# Altium schematic sheet LED_String_AREM-90C0.SchDoc: STB Light Board - 940nm String
size A4; Author: flmoll; DrawnBy: flmoll; Organization: PBL; Revision: A; SheetNumber: 16; SheetTotal: 20
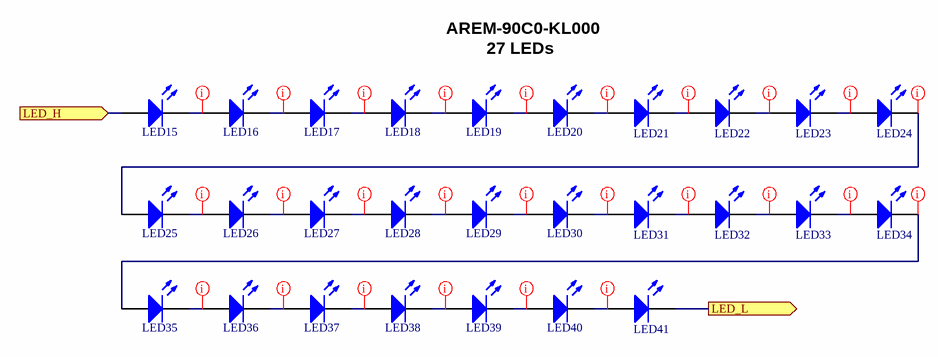
[diagram p0: LED_String_AREM-90C0.SchDoc]

## Parts
LED15  AREM-90C0-KL000  [AREM-80C0-LM000]  (value not drawn)
LED16  AREM-90C0-KL000  [AREM-80C0-LM000]  (value not drawn)
LED17  AREM-90C0-KL000  [AREM-80C0-LM000]  (value not drawn)
LED18  AREM-90C0-KL000  [AREM-80C0-LM000]  (value not drawn)
LED19  AREM-90C0-KL000  [AREM-80C0-LM000]  (value not drawn)
LED20  AREM-90C0-KL000  [AREM-80C0-LM000]  (value not drawn)
LED21  AREM-90C0-KL000  [AREM-80C0-LM000]  (value not drawn)
LED22  AREM-90C0-KL000  [AREM-80C0-LM000]  (value not drawn)
LED23  AREM-90C0-KL000  [AREM-80C0-LM000]  (value not drawn)
LED24  AREM-90C0-KL000  [AREM-80C0-LM000]  (value not drawn)
LED25  AREM-90C0-KL000  [AREM-80C0-LM000]  (value not drawn)
LED26  AREM-90C0-KL000  [AREM-80C0-LM000]  (value not drawn)
LED27  AREM-90C0-KL000  [AREM-80C0-LM000]  (value not drawn)
LED28  AREM-90C0-KL000  [AREM-80C0-LM000]  (value not drawn)
LED29  AREM-90C0-KL000  [AREM-80C0-LM000]  (value not drawn)
LED30  AREM-90C0-KL000  [AREM-80C0-LM000]  (value not drawn)
LED31  AREM-90C0-KL000  [AREM-80C0-LM000]  (value not drawn)
LED32  AREM-90C0-KL000  [AREM-80C0-LM000]  (value not drawn)
LED33  AREM-90C0-KL000  [AREM-80C0-LM000]  (value not drawn)
LED34  AREM-90C0-KL000  [AREM-80C0-LM000]  (value not drawn)
LED35  AREM-90C0-KL000  [AREM-80C0-LM000]  (value not drawn)
LED36  AREM-90C0-KL000  [AREM-80C0-LM000]  (value not drawn)
LED37  AREM-90C0-KL000  [AREM-80C0-LM000]  (value not drawn)
LED38  AREM-90C0-KL000  [AREM-80C0-LM000]  (value not drawn)
LED39  AREM-90C0-KL000  [AREM-80C0-LM000]  (value not drawn)
LED40  AREM-90C0-KL000  [AREM-80C0-LM000]  (value not drawn)
LED41  AREM-90C0-KL000  [AREM-80C0-LM000]  (value not drawn)

## Ports
LED_H (in, see LED_Driver_AREM-90C0[2A]), LED_L (out, see LED_Driver_AREM-90C0[2A])

## Nets
LED_H: LED15.2(A) ; port LED_H
LED_L: LED41.1(K) ; port LED_L
NetLED15_1: LED15.1(K) LED16.2(A)
NetLED16_1: LED16.1(K) LED17.2(A)
NetLED17_1: LED17.1(K) LED18.2(A)
NetLED18_1: LED18.1(K) LED19.2(A)
NetLED19_1: LED19.1(K) LED20.2(A)
NetLED20_1: LED20.1(K) LED21.2(A)
NetLED21_1: LED21.1(K) LED22.2(A)
NetLED22_1: LED22.1(K) LED23.2(A)
NetLED23_1: LED23.1(K) LED24.2(A)
NetLED24_1: LED24.1(K) LED25.2(A)
NetLED25_1: LED25.1(K) LED26.2(A)
NetLED26_1: LED26.1(K) LED27.2(A)
NetLED27_1: LED27.1(K) LED28.2(A)
NetLED28_1: LED28.1(K) LED29.2(A)
NetLED29_1: LED29.1(K) LED30.2(A)
NetLED30_1: LED30.1(K) LED31.2(A)
NetLED31_1: LED31.1(K) LED32.2(A)
NetLED32_1: LED32.1(K) LED33.2(A)
NetLED33_1: LED33.1(K) LED34.2(A)
NetLED34_1: LED34.1(K) LED35.2(A)
NetLED35_1: LED35.1(K) LED36.2(A)
NetLED36_1: LED36.1(K) LED37.2(A)
NetLED37_1: LED37.1(K) LED38.2(A)
NetLED38_1: LED38.1(K) LED39.2(A)
NetLED39_1: LED39.1(K) LED40.2(A)
NetLED40_1: LED40.1(K) LED41.2(A)

## Layout directives
net class LED: NetLED15_1, NetLED16_1, NetLED17_1, NetLED18_1, NetLED19_1, NetLED20_1, NetLED21_1, NetLED22_1, NetLED23_1, NetLED24_1, NetLED25_1, NetLED26_1, NetLED27_1, NetLED28_1, NetLED29_1, NetLED30_1, NetLED31_1, NetLED32_1, NetLED33_1, NetLED34_1, NetLED35_1, NetLED36_1, NetLED37_1, NetLED38_1, NetLED39_1, NetLED40_1

## Notes on the sheet
- AREM-90C0-KL000
- 27 LEDs
- 1
- 2
- 3
- 4
- A
- B
- C
- Project:
- D
- Date:
- Drawing number:
- Rev:
- Format:
- A4 Q
- Drawn by:
- Laboratory:
- Page
- Sheet:
- of
- File:

## Library data of the parts
LED15-LED41 = CMP-02057-1: Infrared (IR) Emitter 940nm 1.4V 70mA 13.4mW/sr @ 70mA (Typ) 120° 2-PLCC; Mfr: Broadcom Limited; Manufacturer: Broadcom; Base Product Number: AREM; Series: AREM-90C0-xx000; Type: Infrared (IR); Current - DC Forward (If) (Max): 70mA; Radiant Intensity (Ie) Min @ If: 13.4mW/sr @ 70mA (Typ); Wavelength: 940nm; Voltage - Forward (Vf) (Typ): 1.4V; Viewing Angle: 120°; Orientation: Top View; Operating Temperature: -40°C ~ 100°C; Mounting Type: Surface Mount; Package / Case: 2-PLCC; Supplier 1: Digi-Key; Supplier Part Number 1: 516-AREM-90C0-KL000DKR-ND; Manufacturer Part Number: AREM-90C0-KL000; RoHS: No; Category: Uncategorized; Stock 1: 47780; Pricing 1: 1=0.62000, 10=0.40500, 100=0.26800, 1000=0.20689 (USD)